# Altium schematic sheet MCU.SchDoc
size A4; SheetNumber: 1; SheetTotal: 4
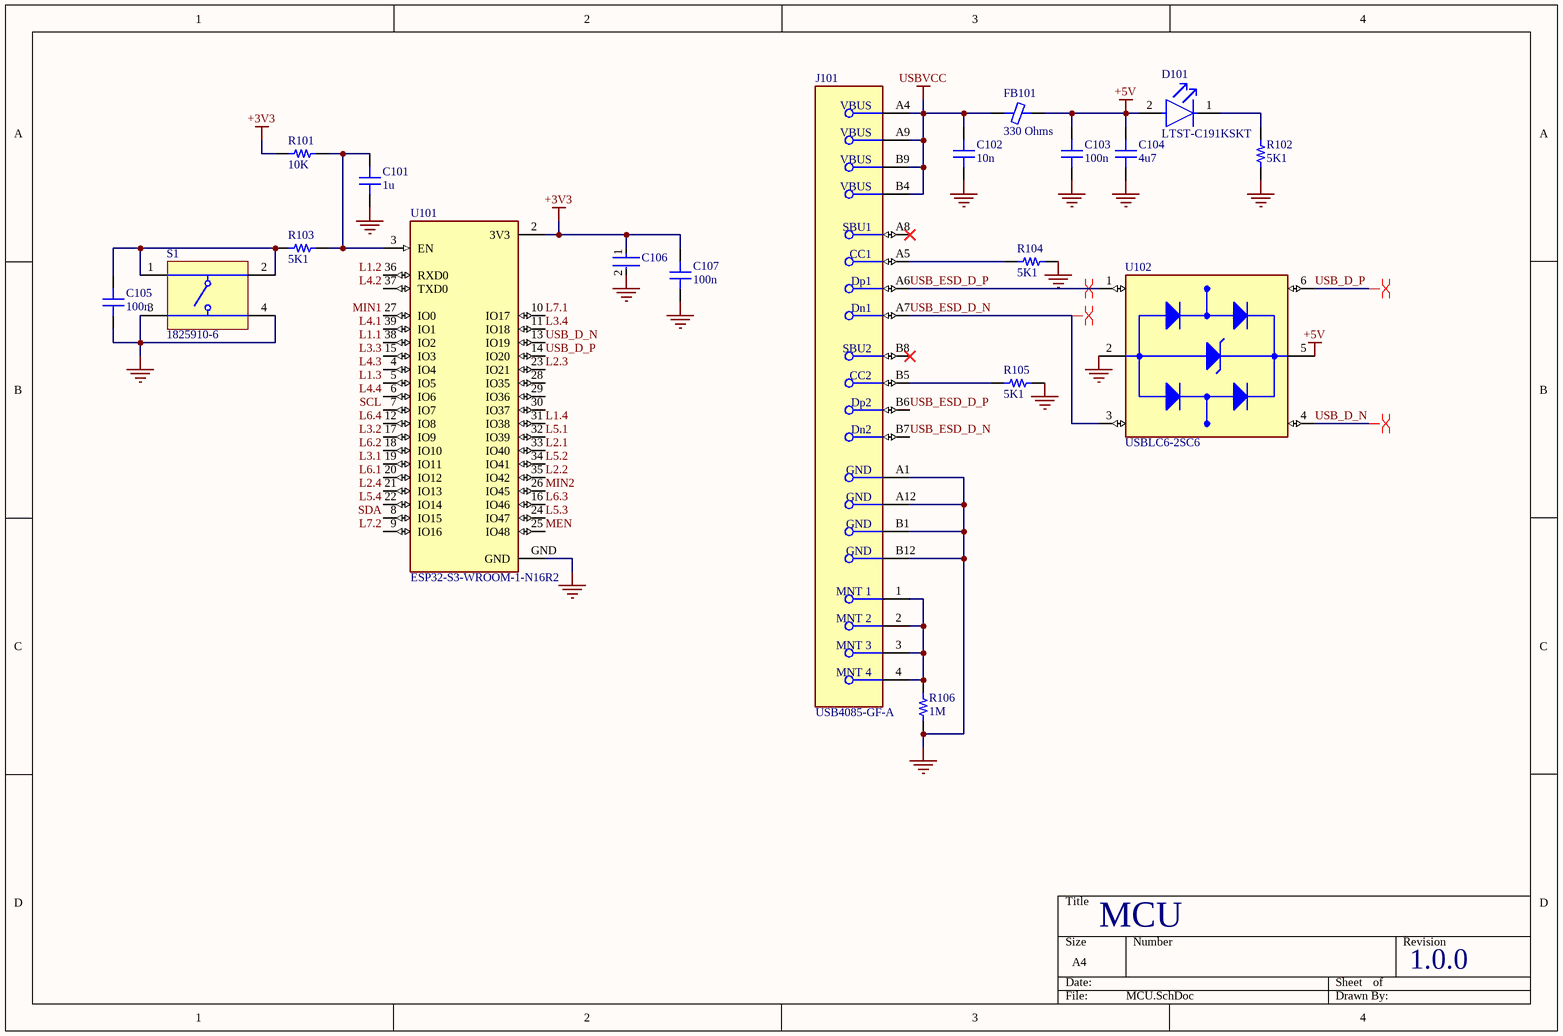
[diagram p0: MCU.SchDoc]

## Parts
C101  1u  [CAP 0402_1005]
C102  10n  [CAP 0402_1005]
C103  100n  [CAP 0402_1005]
C104  4u7  [CAP 0603_1608]
C105  100n  [CAP 0402_1005]
C106  C2012X5R1V226M125AC  [FP-C2012-125-0_2-IPC_C]  (value not drawn)
C107  100n  [CAP 0402_1005]
D101  LTST-C191KSKT  [FP-LTST-C191KSKT-MFG]
FB101  330 Ohms  [FER 0402_1005]
J101  USB4085-GF-A  [FP-USB4085-GF-A-MFG]
R101  10K  [RES 0402_1005]
R102  5K1  [RES 0402_1005]
R103  5K1  [RES 0402_1005]
R104  5K1  [RES 0402_1005]
R105  5K1  [RES 0402_1005]
R106  1M  [RES 0402_1005]
S1  1825910-6  [TECO-1825910-6_V]
U101  ESP32-S3-WROOM-1-N16R2  [XCVR_ESP32-S3-WROOM-1-N16R2]
U102  USBLC6-2SC6  [SOT95P280X145-6N]

## Nets
+3V3: C106.1 C107.2 R101.2 U101.2(3V3)
+5V: C103.2 C104.2 D101.2(A) FB101.2 U102.5(VBUS)
GND: C101.1 C102.1 C103.1 C104.1 C105.1 C106.2 C107.1 J101.A1(GND) J101.A12(GND) J101.B1(GND) J101.B12(GND) R102.1 R104.1 R105.1 R106.1 S1.3 S1.4 U101.GND U102.2(GND)
USBVCC: C102.2 FB101.1 J101.A4(VBUS) J101.A9(VBUS) J101.B4(VBUS) J101.B9(VBUS)
L1.1: U101.38(IO2)
L1.2: U101.36(RXD0)
L1.3: U101.5(IO5)
L1.4: U101.31(IO38)
L2.1: U101.33(IO40)
L2.2: U101.35(IO42)
L2.3: U101.23(IO21)
L2.4: U101.21(IO13)
L3.1: U101.19(IO11)
L3.2: U101.17(IO9)
L3.3: U101.15(IO3)
L3.4: U101.11(IO18)
L4.1: U101.39(IO1)
L4.2: U101.37(TXD0)
L4.3: U101.4(IO4)
L4.4: U101.6(IO6)
L5.1: U101.32(IO39)
L5.2: U101.34(IO41)
L5.3: U101.24(IO47)
L5.4: U101.22(IO14)
L6.1: U101.20(IO12)
L6.2: U101.18(IO10)
L6.3: U101.16(IO46)
L6.4: U101.12(IO8)
L7.1: U101.10(IO17)
L7.2: U101.9(IO16)
MEN: U101.25(IO48)
MIN1: U101.27(IO0)
MIN2: U101.26(IO45)
SCL: U101.7(IO7)
SDA: U101.8(IO15)
USB_D_N: U101.13(IO19) U102.4(I/O2_OUT)
USB_D_P: U101.14(IO20) U102.6(I/O1_OUT)
USB_ESD_D_N: J101.A7(Dn1) J101.B7(Dn2) U102.3(I/O2_IN)
USB_ESD_D_P: J101.A6(Dp1) J101.B6(Dp2) U102.1(I/O1_IN)
NetC101_2: C101.2 R101.1 R103.1 U101.3(EN)
NetC105_2: C105.2 R103.2 S1.1 S1.2
NetD101_1: D101.1(C) R102.2
NetJ101_1: J101.1(MNT_1) J101.2(MNT_2) J101.3(MNT_3) J101.4(MNT_4) R106.2
NetJ101_A5: J101.A5(CC1) R104.2
NetJ101_B5: J101.B5(CC2) R105.2

Not connected (* = marked no-connect by the designer): J101 A8(SBU1)* B8(SBU2)*; U101 28(IO35) 29(IO36) 30(IO37)

## Layout directives
differential pair: USB_D_N, USB_D_P, USB_ESD_D_N, USB_ESD_D_P

## Notes on the sheet
- MCU
- 1.0.0

## Library data of the parts
C101-C103 C105 C107 = CL05B104KP5VPNC: CAP CER 100NF 10V X7R 0402; manufacturer: Samsung Electro-Mechanics; Capacitance: 0.1 µF; Tolerance: ±10%; Part Number: CL05B104KP5VPNC; Applications: Automotive; componentlink1description: Datasheet; componentlink1url: https://mm.digikey.com/Volume0/opasdata/d220001/medias/docus/5458/CL05B104KP5VPNC_Spec.pdf; componentlink2description: DigiKey Link; componentlink2url: https://www.digikey.com/en/products/detail/samsung-electro-mechanics/CL05B104KP5VPNC/20498482; Device Package: 0402 (1005 Metric); lastupdated: 9/02/2024 8:03:17 PM; Lifecycle Status: Active; Minimum Order: 1; Mounting Type: Surface Mount, MLCC; Operating Temperature: -55°C ~ 125°C; Package / Case: 0402 (1005 Metric); packaging: TapeAndReel; partid: 56690; price: 0.01; Ratings: AEC-Q200; series: CL; Size / Dimension: 0.039" L x 0.020" W (1.00mm x 0.50mm); Supplier 1: DigiKey; Supplier Part Number 1: 1276-CL05B104KP5VPNCCT-ND; Temperature Coefficient: X7R; Thickness (Max): 0.022" (0.55mm); Voltage - Rated: 10V
  C101: Value: 1u
  C102: Value: 10n
  C103 C105 C107: Value: 100n
C104 = CL10A475KA8NQNC: CAP CER 4.7UF 25V X5R 0603; manufacturer: Samsung Electro-Mechanics; Capacitance: 4.7 µF; Tolerance: ±10%; Part Number: CL10A475KA8NQNC; Value: 4u7; Applications: General Purpose; componentlink1description: Datasheet; componentlink1url: http://www.samsungsem.com/kr/support/product-search/mlcc/CL10A475KA8NQNC.jsp; componentlink2description: DigiKey Link; componentlink2url: https://www.digikey.com/en/products/detail/samsung-electro-mechanics/CL10A475KA8NQNC/3887558; Device Package: 0603 (1608 Metric); lastupdated: 9/02/2024 8:10:30 PM; Lifecycle Status: Active; Minimum Order: 1; Mounting Type: Surface Mount, MLCC; Operating Temperature: -55°C ~ 85°C; Package / Case: 0603 (1608 Metric); packaging: TapeAndReel; partid: 2349; Part Status: Active; price: 0.06; series: CL; Size / Dimension: 0.063" L x 0.031" W (1.60mm x 0.80mm); Supplier 1: DigiKey; Supplier Part Number 1: 1276-1900-1-ND; Temperature Coefficient: X5R; Thickness (Max): 0.035" (0.90mm); Voltage - Rated: 25V
C106 = CMP-2000-06038-3: Multilayer Ceramic Capacitors 22μF ±20% 35V X5R SMD 0805; Capacitance: 22uF; Tolerance: 20%; RoHS Compliant: Yes; Height: 1.25mm; Termination: SMD/SMT; Case/Package: 0805; Thickness: 0.057inch; Max Operating Temperature: 85°C; Min Operating Temperature: -55°C; Voltage Rating (DC): 35V; Length: 0.079inch; Dielectric: X5R; Dielectric Material: Ceramic; Voltage Rating: 35V; Mount: Surface Mount; Package Quantity: 2000; Lead Free: Lead Free; Weight: 0.000194oz; REACH SVHC: No SVHC; Width: 0.049inch; Packaging: Tape and Reel; Series: C; Case Code (Metric): 2012; Case Code (Imperial): 0805
D101 = CMP-22017-000025-1: LED YELLOW CLEAR SMD; Dominant Wavelength: 597nm; Power Rating: 75mW; Number of LEDs: 1; Lens Style: Diffused; Forward Current: 30mA; Test Current: 20mA; Forward Voltage: 2.4V; Wavelength: 588nm; Viewing Angle: 130°; Lens Color: Colorless; Reverse Voltage: 5V; Luminous Intensity: 180mcd; Case Code (Imperial): 0603; Width: 0.8mm; Power Dissipation: 75mW; Length: 1.6mm; Illumination Color: Yellow; Number of Pins: 2; Case Code (Metric): 1608; Mount: Surface Mount; Number of Elements: 1; Height: 0.55mm; Lens Transparency: Clear; Depth: 0.8mm; Min Operating Temperature: -55°C; Case/Package: 0603; Radiation Hardening: No; Max Operating Temperature: 85°C; Package Quantity: 1; Packaging: Tape and Reel; Lead Free: Lead Free; Color: Yellow
FB101 = Z0402C121ASMST: FERRITE BEAD 120 OHM 0402 1LN; Manufacturer: KEMET; Current Rating (Max): 500mA; DC Resistance (DCR) (Max): 230mOhm; Filter Type: Signal Line; Impedance @ Frequency: 120 Ohms @ 100MHz; Number of Lines: 1; Value: 120 Ohms @ 100MHz; Part Number: Z0402C121ASMST; ComponentLink1Description: Datasheet; ComponentLink1URL: https://content.kemet.com/datasheets/F3115.pdf; ComponentLink2Description: DigiKey Link; ComponentLink2URL: http://digikey.com/product-detail/en/kemet/Z0402C121ASMST/399-17794-1-ND/8601457; Device Package: 0402 (1005 Metric); Height (Max): 0.022" (0.55mm); LastUpdated: 11/03/2024 7:42:43 AM; Lifecycle Status: Active; Minimum Order: 1; Mounting Type: Surface Mount; Operating Temperature: -55°C ~ 125°C; Package / Case: 0402 (1005 Metric); Packaging: TapeAndReel; PartId: 159; Part Status: Active; Price: 0.03; Series: Z-SMS; Size / Dimension: 0.039" L x 0.020" W (1.00mm x 0.50mm); Supplier 1: DigiKey; Supplier Part Number 1: 399-17794-1-ND
J101 = CMP-196119-000001-2: CONN RCPT USB2.0 TYPE C 24POS RA; Gender: Receptacle; Number of Positions: 16; USB Standard: USB 2.0; Orientation: Right Angle; Contact Plating: Gold; Contact Material: Copper Alloy
R101-R106 = AC0402JR-075K1L: RES SMD 5.1K OHM 5% 1/16W 0402; Manufacturer: Yageo; Power (Watts): 0.063W, 1/16W; Resistance: 5.1 kOhms; Temperature Coefficient: ±100ppm/°C; Part Number: AC0402JR-075K1L; ComponentLink1Description: Datasheet; ComponentLink1URL: https://www.yageo.com/upload/media/product/productsearch/datasheet/rchip/PYu-AC_51_RoHS_L_7.pdf; ComponentLink2Description: DigiKey Link; ComponentLink2URL: https://www.digikey.com/en/products/detail/yageo/AC0402JR-075K1L/5895695; Composition: Thick Film; Device Package: 0402 (1005 Metric); Features: Automotive AEC-Q200, Moisture Resistant; Height - Seated (Max): 0.015" (0.37mm); LastUpdated: 9/02/2024 8:30:14 PM; Lifecycle Status: Active; Minimum Order: 1; Number of Terminations: 2; Operating Temperature: -55°C ~ 155°C; Package / Case: 0402 (1005 Metric); Packaging: CutTape; PartId: 4690; Part Status: Active; Price: 0.01; Ratings: AEC-Q200; Series: AC; Size / Dimension: 0.039" L x 0.020" W (1.00mm x 0.50mm); Supplier 1: DigiKey; Supplier Part Number 1: YAG3554CT-ND; Supplier Device Package: 0402; Tolerance: ±5%
  R101: Value: 10K
  R102-R105: Value: 5K1
  R106: Value: 1M
S1 = CMP-1684-00021-1: Tact Switch, SPST-NO, 0.05 A, -35 to 85 degC, 4-Pin THD, RoHS, Bulk; Manufacturer: TE Connectivity; Maximum Contact Resistance: 100mOhm; Mechanical Life: 100000Cycles; Bushing Type: Unthreaded; Switch Configuration: OFF(ON); Maximum DC Voltage Rating: 24V; Contact Rating @ Voltage: 0.05A@24VDC; Actuator Color: Black; Body Orientation: Straight; Function: MomentaryContact; Illumination: N/R; Actuator Style: RoundButton; Actuator Material: PolybutyleneTerephthalate; Dielectric Strength: 500VAC; Pole Throw Configuration: SPST; Actuator Length: 1.4mm; Product Weight: N/A; Contact Material: CopperAlloy; Housing Material: N/A; Terminal Type: PCPins; Minimum Insulation Resistance: 100MOhm; Package Description: 4-Pin Through Hole Device, Body 5.99 x 5.99 mm, Pitch 6.5 mm; Part No: 1825910-6; Package Reference: THD; Base Material: N/A; Manufacturer URL: http://www.te.com; Contact Plating: Silver; RoHS: Yes; Datasheet Version: Rev. C9; Electrical Life: 100000Cycles; Maximum AC Voltage Rating: N/A; Thread Size: N/R; Operating Temperature: -35to85C; Mounting: ThroughHole; Dimension: 5.99x5mm; Datasheet URL: http://www.te.com/commerce/DocumentDelivery/DDEController?Action=showdoc&DocId=Customer+Drawing%7F1825910%7FC9%7Fpdf%7FEnglish%7FENG_CD_1825910_C9.pdf%7F1825910-6; Family: 1825910; Seal Location: N/A; Seal Description: N/A; Packaging: N/A
U101 = ESP32-S3-WROOM-1-N16R2: Bluetooth, WiFi 802.11b/g/n, Bluetooth v5.0 Transceiver Module 2.4GHz PCB Trace Surface Mount; MF: Espressif Systems; MP: ESP32S3WROOM1N16R2; SnapEDA_Link: https://www.snapeda.com/parts/ESP32S3WROOM1N16R2/Espressif+Systems/view-part/?ref=snap; Package: NON STANDARD Espressif Systems; Value: *; Check_prices: https://www.snapeda.com/parts/ESP32S3WROOM1N16R2/Espressif+Systems/view-part/?ref=eda
U102 = USBLC6-2SC6: 17V Clamp 5A (8/20Âµs) Ipp Tvs Diode Surface Mount SOT-23-6; MF: STMicroelectronics; Value: *; SnapEDA_Link: https://www.snapeda.com/parts/USBLC6-2SC6/STMicroelectronics/view-part/?ref=snap; Check_prices: https://www.snapeda.com/parts/USBLC6-2SC6/STMicroelectronics/view-part/?ref=eda; Purchase-URL: https://pricing.snapeda.com/search/part/USBLC6-2SC6/?ref=eda; Price: None; Availability: In Stock; Package: SOT-23-6 STMicroelectronics; MP: USBLC6-2SC6